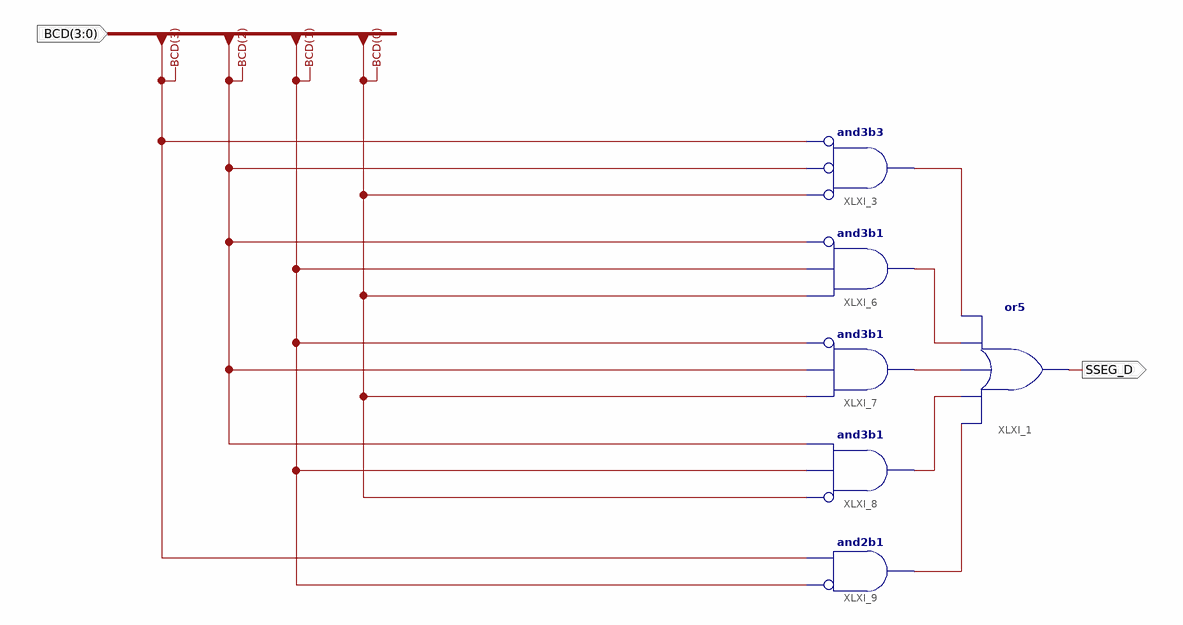
[diagram p0: schematic sheet 1]
// Xilinx ISE schematic SSEG_D.sch (spartan6) as structural Verilog: 6 symbols, 2 ports
module SSEG_D (
  input  [3:0] BCD,
  output SSEG_D
);

  wire XLXN_9, XLXN_10, XLXN_12, XLXN_13, XLXN_14;

  or XLXI_1 (SSEG_D, XLXN_12, XLXN_10, XLXN_9, XLXN_13, XLXN_14);
  and XLXI_3 (XLXN_14, ~BCD[0], ~BCD[2], ~BCD[3]);  // and3b3
  and XLXI_6 (XLXN_13, ~BCD[2], BCD[1], BCD[0]);  // and3b1
  and XLXI_7 (XLXN_9, ~BCD[1], BCD[2], BCD[0]);  // and3b1
  and XLXI_8 (XLXN_10, ~BCD[0], BCD[1], BCD[2]);  // and3b1
  and XLXI_9 (XLXN_12, ~BCD[1], BCD[3]);  // and2b1
endmodule
